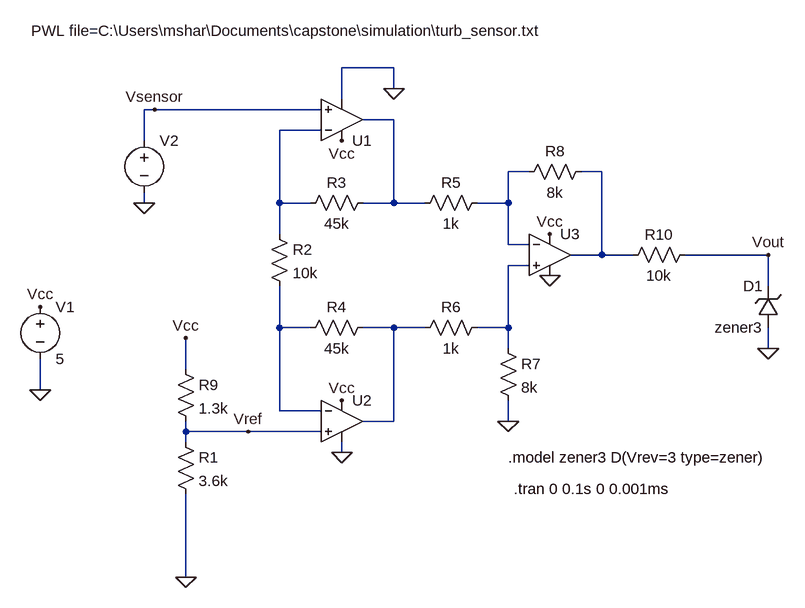
[diagram p0: schematic turbiditySensor.asc]
turbiditySensor.asc, the LTspice schematic file:
Version 4
SHEET 1 1728 680
WIRE 320 -176 240 -176
WIRE 320 -144 320 -176
WIRE 240 -128 240 -176
WIRE -48 -112 -64 -112
WIRE 208 -112 -48 -112
WIRE 320 -96 272 -96
WIRE 208 -80 144 -80
WIRE -64 -64 -64 -112
WIRE 528 -16 496 -16
WIRE 640 -16 608 -16
WIRE -64 32 -64 16
WIRE 144 32 144 -80
WIRE 192 32 144 32
WIRE 320 32 320 -96
WIRE 320 32 272 32
WIRE 368 32 320 32
WIRE 496 32 496 -16
WIRE 496 32 448 32
WIRE 144 80 144 32
WIRE 496 96 496 32
WIRE 528 96 496 96
WIRE 640 112 640 -16
WIRE 640 112 592 112
WIRE 688 112 640 112
WIRE 896 112 768 112
WIRE 528 128 496 128
WIRE 896 160 896 112
WIRE 144 224 144 160
WIRE 192 224 144 224
WIRE 320 224 272 224
WIRE 368 224 320 224
WIRE 496 224 496 128
WIRE 496 224 448 224
WIRE 496 256 496 224
WIRE 896 256 896 224
WIRE 0 288 0 240
WIRE -224 320 -224 272
WIRE 144 352 144 224
WIRE 208 352 144 352
WIRE 320 368 320 224
WIRE 320 368 272 368
WIRE 496 368 496 336
WIRE 0 384 0 368
WIRE 96 384 0 384
WIRE 208 384 96 384
WIRE 0 400 0 384
WIRE 240 416 240 400
WIRE 0 608 0 480
FLAG -224 192 Vcc
FLAG -64 32 0
FLAG -224 320 0
FLAG 560 144 0
FLAG 320 -144 0
FLAG 240 416 0
FLAG 240 -64 Vcc
FLAG 240 336 Vcc
FLAG 560 80 Vcc
FLAG 496 368 0
FLAG 0 240 Vcc
FLAG 0 608 0
FLAG 896 112 Vout
FLAG -48 -112 Vsensor
FLAG 96 384 Vref
FLAG 896 256 0
SYMBOL voltage -224 176 R0
WINDOW 123 0 0 Left 0
WINDOW 39 0 0 Left 0
SYMATTR InstName V1
SYMATTR Value 5
SYMBOL voltage -64 -80 R0
WINDOW 3 -174 -153 Left 2
WINDOW 123 0 0 Left 0
WINDOW 39 0 0 Left 0
SYMATTR InstName V2
SYMATTR Value PWL file=C:\Users\mshar\Documents\capstone\simulation\turb_sensor.txt
SYMBOL OpAmps\\UniversalOpAmp2 240 -96 M180
SYMATTR InstName U1
SYMBOL OpAmps\\UniversalOpAmp2 240 368 R0
SYMATTR InstName U2
SYMBOL OpAmps\\UniversalOpAmp2 560 112 R0
SYMATTR InstName U3
SYMBOL res 128 64 R0
SYMATTR InstName R2
SYMATTR Value 10k
SYMBOL res 288 16 R90
WINDOW 0 0 56 VBottom 2
WINDOW 3 32 56 VTop 2
SYMATTR InstName R3
SYMATTR Value 45k
SYMBOL res 288 208 R90
WINDOW 0 0 56 VBottom 2
WINDOW 3 32 56 VTop 2
SYMATTR InstName R4
SYMATTR Value 45k
SYMBOL res 464 16 R90
WINDOW 0 0 56 VBottom 2
WINDOW 3 32 56 VTop 2
SYMATTR InstName R5
SYMATTR Value 1k
SYMBOL res 464 208 R90
WINDOW 0 0 56 VBottom 2
WINDOW 3 32 56 VTop 2
SYMATTR InstName R6
SYMATTR Value 1k
SYMBOL res 480 240 R0
SYMATTR InstName R7
SYMATTR Value 8k
SYMBOL res 624 -32 R90
WINDOW 0 0 56 VBottom 2
WINDOW 3 32 56 VTop 2
SYMATTR InstName R8
SYMATTR Value 8k
SYMBOL res -16 384 R0
SYMATTR InstName R1
SYMATTR Value 3.6k
SYMBOL res -16 272 R0
SYMATTR InstName R9
SYMATTR Value 1.3k
SYMBOL zener 912 224 R180
WINDOW 0 24 64 Left 2
WINDOW 3 24 0 Left 2
SYMATTR InstName D1
SYMATTR Value zener3
SYMBOL res 784 96 R90
WINDOW 0 0 56 VBottom 2
WINDOW 3 32 56 VTop 2
SYMATTR InstName R10
SYMATTR Value 10k
TEXT 504 472 Left 2 !.tran 0 0.1s 0 0.001ms
TEXT 496 424 Left 2 !.model zener3 D(Vrev=3 type=zener)

The netlist it stands for:
* turbiditySensor.asc
V1 Vcc 0 5
V2 Vsensor 0 PWL file=C:\Users\mshar\Documents\capstone\simulation\turb_sensor.txt
XU1 Vsensor N002 Vcc 0 N001 level2 Avol=1Meg GBW=10Meg Slew=10Meg Ilimit=25m Rail=0 Vos=0 En=0 Enk=0 In=0 Ink=0 Rin=500Meg  ; pins In+ In- V+ V- OUT
XU2 Vref N006 Vcc 0 N007 level2 Avol=1Meg GBW=10Meg Slew=10Meg Ilimit=25m Rail=0 Vos=0 En=0 Enk=0 In=0 Ink=0 Rin=500Meg  ; pins In+ In- V+ V- OUT
XU3 N005 N003 Vcc 0 N004 level2 Avol=1Meg GBW=10Meg Slew=10Meg Ilimit=25m Rail=0 Vos=0 En=0 Enk=0 In=0 Ink=0 Rin=500Meg  ; pins In+ In- V+ V- OUT
R2 N002 N006 10k
R3 N001 N002 45k
R4 N007 N006 45k
R5 N003 N001 1k
R6 N005 N007 1k
R7 N005 0 8k
R8 N004 N003 8k
R1 Vref 0 3.6k
R9 Vcc Vref 1.3k
D1 0 Vout zener3
R10 Vout N004 10k
.model D D
.lib standard.dio
.tran 0 0.1s 0 0.001ms
.model zener3 D(Vrev=3 type=zener)
.lib UniversalOpAmp2.lib
.backanno
.end